# Altium schematic sheet Interface - SWD.SchDoc: [19] Interface - SWD
size A4; SheetNumber: 19; SheetTotal: 26
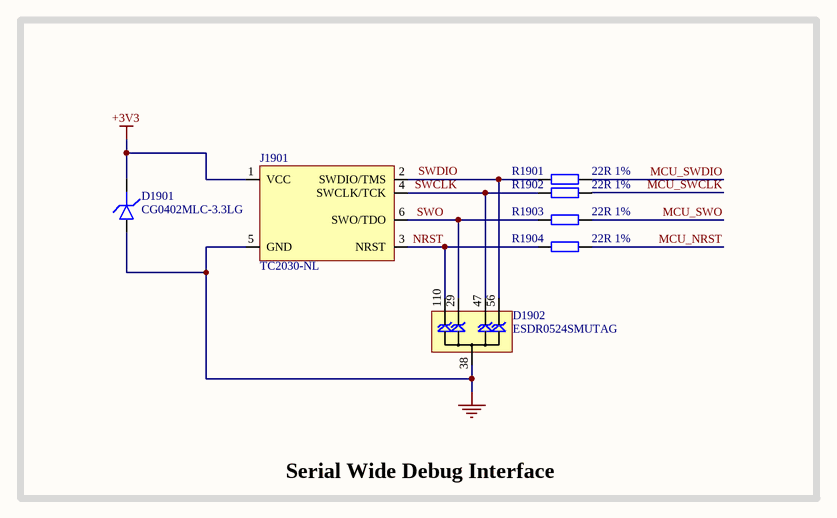
[diagram p0: Interface - SWD.SchDoc]

## Parts
D1901  CG0402MLC-3.3LG  [D_0402]
D1902  ESDR0524SMUTAG  [uDFN-10-WIDE]
J1901  TC2030-NL  [TC2030-NL-FP]  (no BOM)
R1901  22R 1%  [RES_0402]
R1902  22R 1%  [RES_0402]
R1903  22R 1%  [RES_0402]
R1904  22R 1%  [RES_0402]

## Blocks framed on the sheet
Serial Wide Debug Interface: D1901 D1902 J1901 R1901-R1904

## Nets
+3V3: D1901.K J1901.1(VCC)
GND: D1901.A D1902.38(GND) J1901.5(GND)
MCU_NRST: R1904.1
MCU_SWCLK: R1902.1
MCU_SWDIO: R1901.1
MCU_SWO: R1903.1
NRST: D1902.110 J1901.3(NRST) R1904.2
SWCLK: D1902.47 J1901.4(SWCLK/TCK) R1902.2
SWDIO: D1902.56 J1901.2(SWDIO/TMS) R1901.2
SWO: D1902.29 J1901.6(SWO/TDO) R1903.2

## Notes on the sheet
- Title:
- Drawn By:
- Page Contents:
- Checked By:
- Size:
- Date:
- File:
- License:
- Email:
- A4
- Number:
- Time:
- Revision:
- Sheet
- Website:
- of

## Library data of the parts
D1901 = D_TVS_0402: Diode TVS / ESD 0402
D1902 = ESDR0524SMUTAG: TVS Diode Array Low Capacitance ESD Protection 4-Channel (Vwork=5V, Vclamp=15V); Manufacturer: onsemi; Manufacturer Part Number: ESDR0524SMUTAG; Distributor Link: https://www.mouser.de/ProductDetail/onsemi/ESDR0524SMUTAG?qs=NJQfjRgVp6Qe%2FuopsuIgOg%3D%3D; LCSC: C890633
J1901 = TC2030-NL: Tag-Connect No-Solder SWD Debug Connector (No Legs) DO NOT PLACE; Manufacturer: Tag-Connect; Manufacturer Part Number: TC2030-NL-FP
R1901-R1904 = RES_0402: Resistor SMD 0402; Manufacturer: PANASONIC; Manufacturer Part Number: ERJPA2F22R0X; Distributor Link: www.lcsc.com; LCSC: C427230